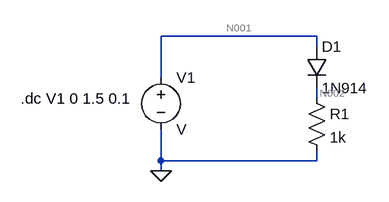
[diagram p0: schematic circuito1.asc]
circuito1.asc, the LTspice schematic file:
Version 4
SHEET 1 880 680
WIRE 304 80 64 80
WIRE 304 96 304 80
WIRE 64 144 64 80
WIRE 304 176 304 160
WIRE 64 272 64 224
WIRE 304 272 304 256
WIRE 304 272 64 272
WIRE 64 288 64 272
FLAG 64 288 0
SYMBOL voltage 64 128 R0
SYMATTR InstName V1
SYMBOL diode 288 96 R0
SYMATTR InstName D1
SYMATTR Value 1N914
SYMBOL res 288 160 R0
SYMATTR InstName R1
SYMATTR Value 1k
TEXT -152 176 Left 2 !.dc V1 0 1.5 0.1

The netlist it stands for:
* circuito1.asc
V1 N001 0 V
D1 N001 N002 1N914
R1 N002 0 1k
.model D D
.lib standard.dio
.dc V1 0 1.5 0.1
.backanno
.end

* Results of the author's LTspice run, read from the files saved beside the schematic
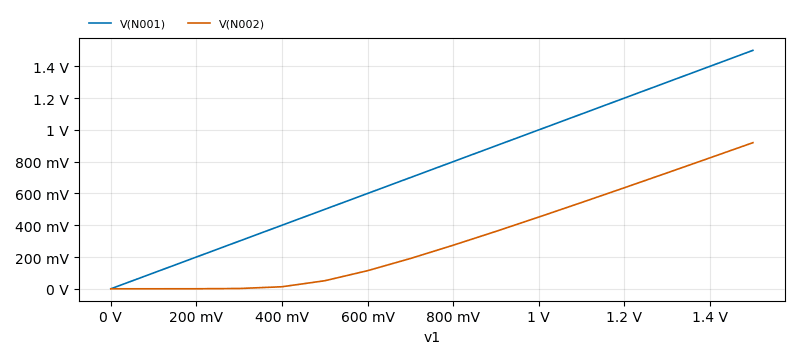
[diagram p1: DC transfer characteristic of circuito1.asc, plotted from the saved traces]
* DC transfer characteristic, 1 run:
*   V(N001): 0 V at v1=0 V, 1.5 V at v1=1.5 V, min 0 V, max 1.5 V
*   V(N002): 0 V at v1=0 V, 919.1 mV at v1=1.5 V, min 0 V, max 919.1 mV